# Altium project chronos-pcb.PrjPcb (part 2 of 2)

## Sheet tube-control.SchDoc
size B portrait; SheetNumber: 7; SheetTotal: 9
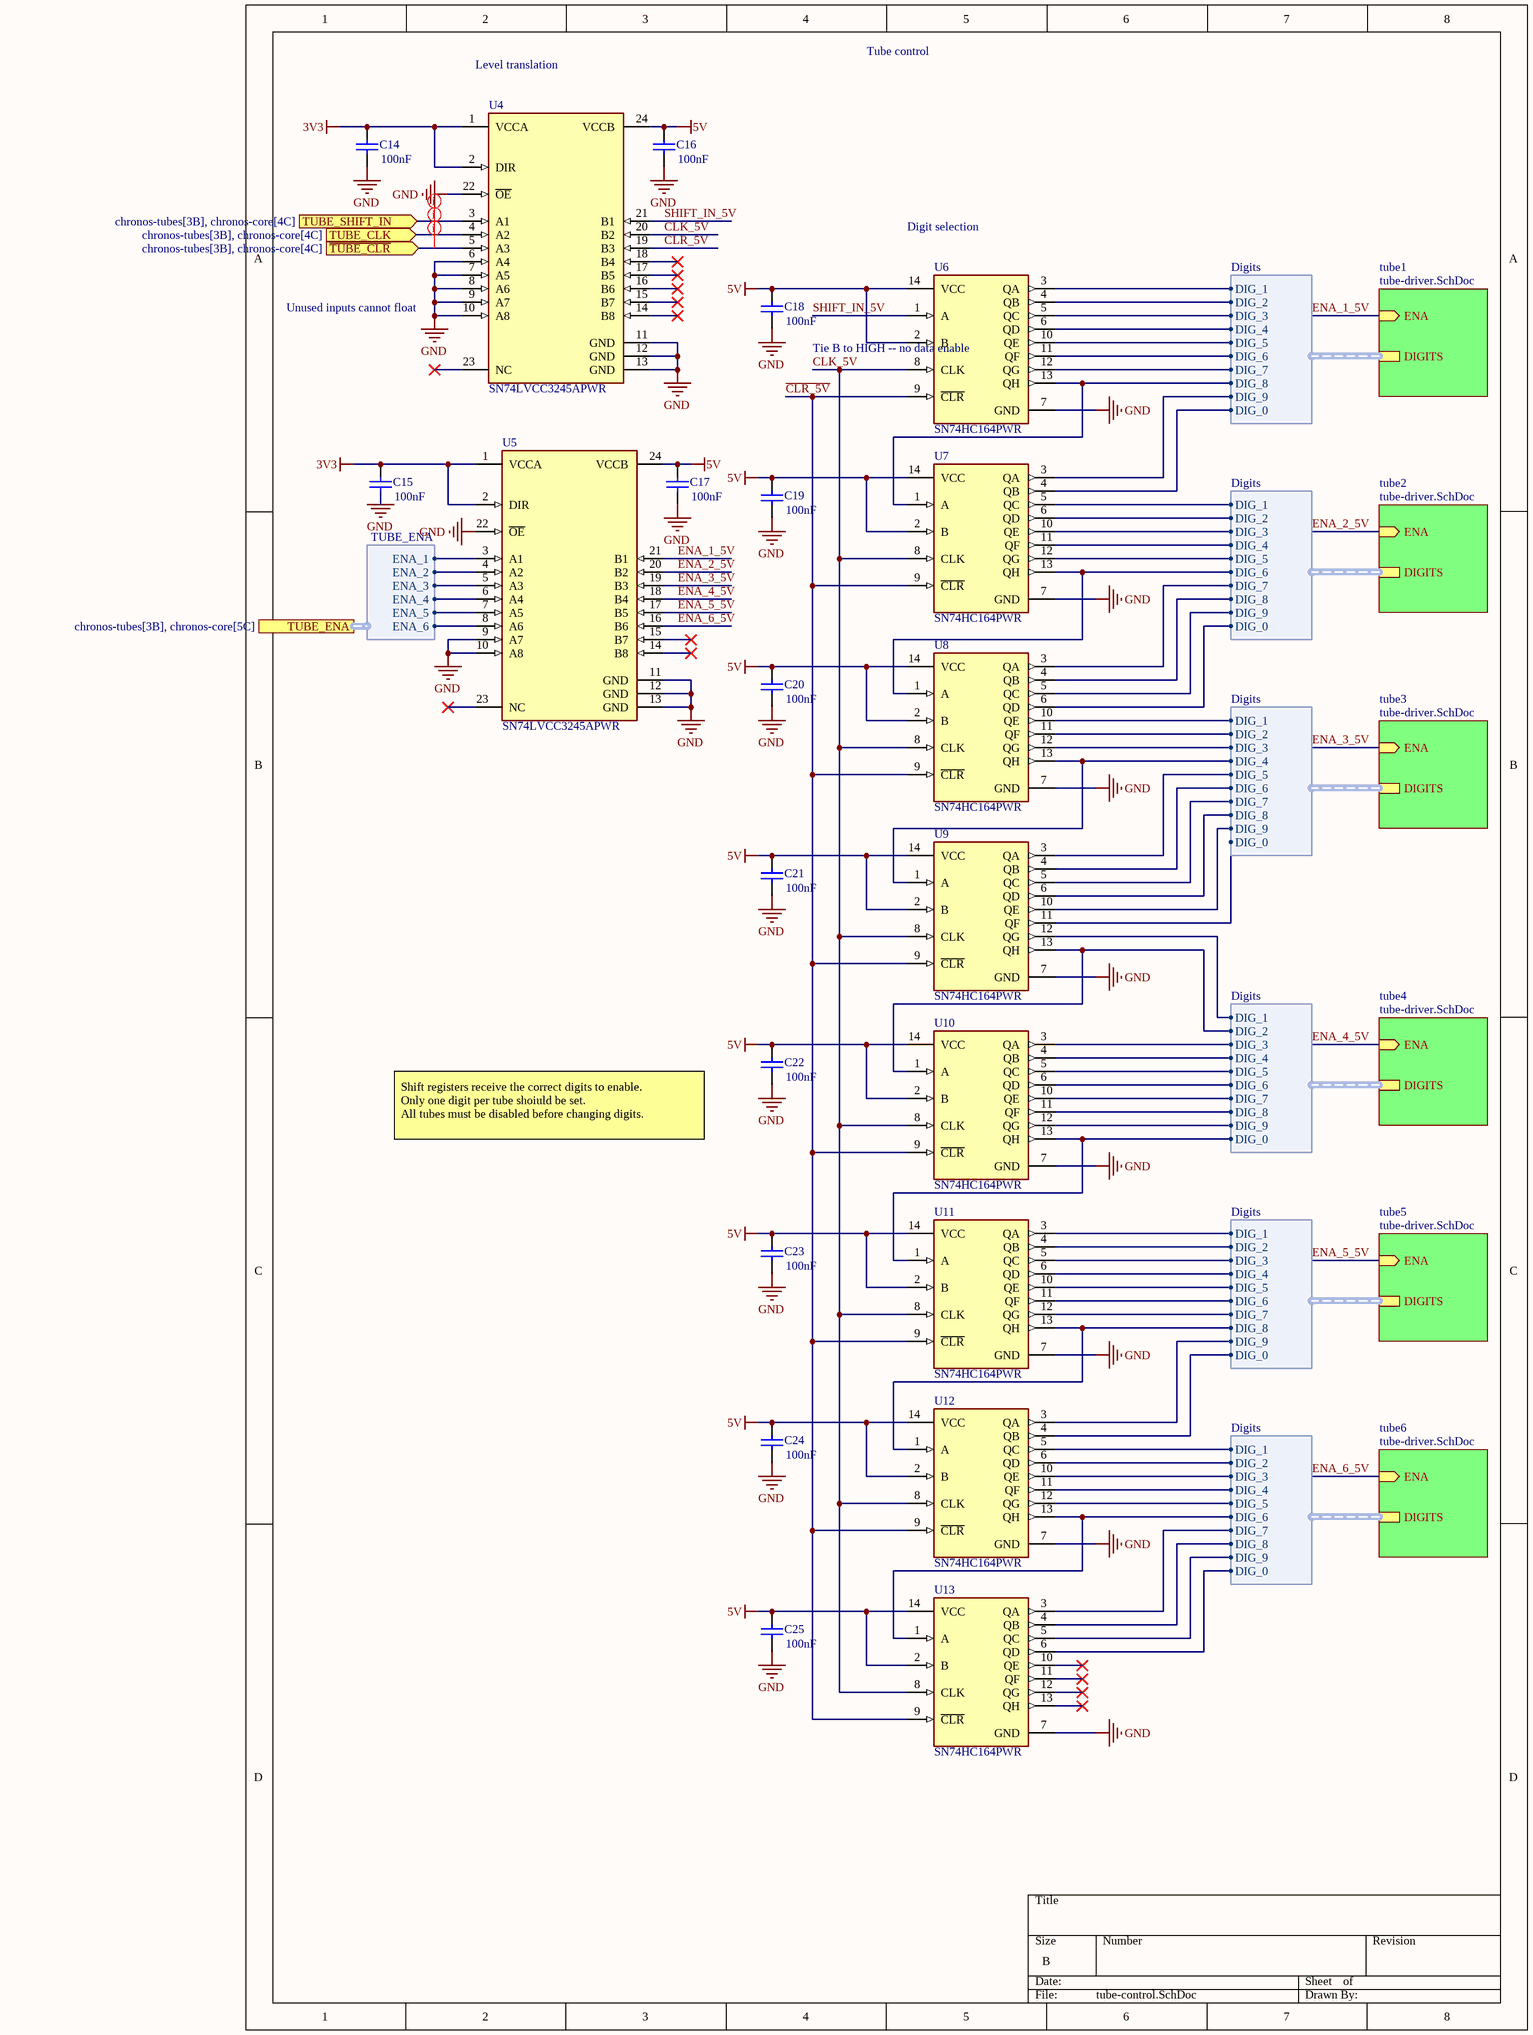
[diagram p7: tube-control.SchDoc]

### Parts
C14  Capacitance: 100nF  [CAPC1050X55X23ML05T13]  (hidden comment: CL05B104KO5NNNC)
C15  Capacitance: 100nF  [CAPC1050X55X23ML05T13]  (hidden comment: CL05B104KO5NNNC)
C16  Capacitance: 100nF  [CAPC1050X55X23ML05T13]  (hidden comment: CL05B104KO5NNNC)
C17  Capacitance: 100nF  [CAPC1050X55X23ML05T13]  (hidden comment: CL05B104KO5NNNC)
C18  Capacitance: 100nF  [CAPC1050X55X23ML05T13]  (hidden comment: CL05B104KO5NNNC)
C19  Capacitance: 100nF  [CAPC1050X55X23ML05T13]  (hidden comment: CL05B104KO5NNNC)
C20  Capacitance: 100nF  [CAPC1050X55X23ML05T13]  (hidden comment: CL05B104KO5NNNC)
C21  Capacitance: 100nF  [CAPC1050X55X23ML05T13]  (hidden comment: CL05B104KO5NNNC)
C22  Capacitance: 100nF  [CAPC1050X55X23ML05T13]  (hidden comment: CL05B104KO5NNNC)
C23  Capacitance: 100nF  [CAPC1050X55X23ML05T13]  (hidden comment: CL05B104KO5NNNC)
C24  Capacitance: 100nF  [CAPC1050X55X23ML05T13]  (hidden comment: CL05B104KO5NNNC)
C25  Capacitance: 100nF  [CAPC1050X55X23ML05T13]  (hidden comment: CL05B104KO5NNNC)
U4  SN74LVCC3245APWR  [FP-PW0024A-MFG]
U5  SN74LVCC3245APWR  [FP-PW0024A-MFG]
U6  SN74HC164PWR  [FP-PW0014A-MFG]
U7  SN74HC164PWR  [FP-PW0014A-MFG]
U8  SN74HC164PWR  [FP-PW0014A-MFG]
U9  SN74HC164PWR  [FP-PW0014A-MFG]
U10  SN74HC164PWR  [FP-PW0014A-MFG]
U11  SN74HC164PWR  [FP-PW0014A-MFG]
U12  SN74HC164PWR  [FP-PW0014A-MFG]
U13  SN74HC164PWR  [FP-PW0014A-MFG]

### Sub-sheets
tube1 = tube-driver.SchDoc: ENA (in), DIGITS (harness Digits)
tube2 = tube-driver.SchDoc: ENA (in), DIGITS (harness Digits)
tube3 = tube-driver.SchDoc: ENA (in), DIGITS (harness Digits)
tube4 = tube-driver.SchDoc: ENA (in), DIGITS (harness Digits)
tube5 = tube-driver.SchDoc: ENA (in), DIGITS (harness Digits)
tube6 = tube-driver.SchDoc: ENA (in), DIGITS (harness Digits)

### Ports
TUBE_CLK (in, see chronos-tubes[3B], chronos-core[4C]), TUBE_ENA (harness TUBE_ENA, see chronos-tubes[3B], chronos-core[5C]), TUBE_SHIFT_IN (in, see chronos-tubes[3B], chronos-core[4C]), ~{TUBE_CLR} (in, see chronos-tubes[3B], chronos-core[4C])

### Harnesses
Digits: DIG_1, DIG_2, DIG_3, DIG_4, DIG_5, DIG_6, DIG_7, DIG_8, DIG_9, DIG_0
TUBE_ENA: ENA_1, ENA_2, ENA_3, ENA_4, ENA_5, ENA_6

### Nets
3V3: C14.2 C15.2 U4.1(VCCA) U4.2(DIR) U5.1(VCCA) U5.2(DIR)
5V: C16.2 C17.2 C18.2 C19.2 C20.2 C21.2 C22.2 C23.2 C24.2 C25.2 U4.24(VCCB) U5.24(VCCB) U6.2(B) U6.14(VCC) U7.2(B) U7.14(VCC) U8.2(B) U8.14(VCC) U9.2(B) U9.14(VCC) U10.2(B) U10.14(VCC) U11.2(B) U11.14(VCC) U12.2(B) U12.14(VCC) U13.2(B) U13.14(VCC)
GND: C14.1 C15.1 C16.1 C17.1 C18.1 C19.1 C20.1 C21.1 C22.1 C23.1 C24.1 C25.1 U4.6(A4) U4.7(A5) U4.8(A6) U4.9(A7) U4.10(A8) U4.11(GND) U4.12(GND) U4.13(GND) U4.22(~{OE}) U5.9(A7) U5.10(A8) U5.11(GND) U5.12(GND) U5.13(GND) U5.22(~{OE}) U6.7(GND) U7.7(GND) U8.7(GND) U9.7(GND) U10.7(GND) U11.7(GND) U12.7(GND) U13.7(GND)
~{CLR_5V}: U4.19(B3) U6.9(~{CLR}) U7.9(~{CLR}) U8.9(~{CLR}) U9.9(~{CLR}) U10.9(~{CLR}) U11.9(~{CLR}) U12.9(~{CLR}) U13.9(~{CLR})
CLK_5V: U4.20(B2) U6.8(CLK) U7.8(CLK) U8.8(CLK) U9.8(CLK) U10.8(CLK) U11.8(CLK) U12.8(CLK) U13.8(CLK)
DIG_0: U7.4(QB) ; sheet tube1/DIGITS.DIG_0
DIG_0: U8.6(QD) ; sheet tube2/DIGITS.DIG_0  [a separate net that carries the same name]
DIG_0: U9.11(QF) ; sheet tube3/DIGITS.DIG_0  [a separate net that carries the same name]
DIG_0: U10.13(QH) U11.1(A) ; sheet tube4/DIGITS.DIG_0  [a separate net that carries the same name]
DIG_0: U12.4(QB) ; sheet tube5/DIGITS.DIG_0  [a separate net that carries the same name]
DIG_0: U13.6(QD) ; sheet tube6/DIGITS.DIG_0  [a separate net that carries the same name]
DIG_1: U6.3(QA) ; sheet tube1/DIGITS.DIG_1
DIG_1: U7.5(QC) ; sheet tube2/DIGITS.DIG_1  [a separate net that carries the same name]
DIG_1: U8.10(QE) ; sheet tube3/DIGITS.DIG_1  [a separate net that carries the same name]
DIG_1: U9.12(QG) ; sheet tube4/DIGITS.DIG_1  [a separate net that carries the same name]
DIG_1: U11.3(QA) ; sheet tube5/DIGITS.DIG_1  [a separate net that carries the same name]
DIG_1: U12.5(QC) ; sheet tube6/DIGITS.DIG_1  [a separate net that carries the same name]
DIG_2: U6.4(QB) ; sheet tube1/DIGITS.DIG_2
DIG_2: U7.6(QD) ; sheet tube2/DIGITS.DIG_2  [a separate net that carries the same name]
DIG_2: U8.11(QF) ; sheet tube3/DIGITS.DIG_2  [a separate net that carries the same name]
DIG_2: U9.13(QH) U10.1(A) ; sheet tube4/DIGITS.DIG_2  [a separate net that carries the same name]
DIG_2: U11.4(QB) ; sheet tube5/DIGITS.DIG_2  [a separate net that carries the same name]
DIG_2: U12.6(QD) ; sheet tube6/DIGITS.DIG_2  [a separate net that carries the same name]
DIG_3: U6.5(QC) ; sheet tube1/DIGITS.DIG_3
DIG_3: U7.10(QE) ; sheet tube2/DIGITS.DIG_3  [a separate net that carries the same name]
DIG_3: U8.12(QG) ; sheet tube3/DIGITS.DIG_3  [a separate net that carries the same name]
DIG_3: U10.3(QA) ; sheet tube4/DIGITS.DIG_3  [a separate net that carries the same name]
DIG_3: U11.5(QC) ; sheet tube5/DIGITS.DIG_3  [a separate net that carries the same name]
DIG_3: U12.10(QE) ; sheet tube6/DIGITS.DIG_3  [a separate net that carries the same name]
DIG_4: U6.6(QD) ; sheet tube1/DIGITS.DIG_4
DIG_4: U7.11(QF) ; sheet tube2/DIGITS.DIG_4  [a separate net that carries the same name]
DIG_4: U8.13(QH) U9.1(A) ; sheet tube3/DIGITS.DIG_4  [a separate net that carries the same name]
DIG_4: U10.4(QB) ; sheet tube4/DIGITS.DIG_4  [a separate net that carries the same name]
DIG_4: U11.6(QD) ; sheet tube5/DIGITS.DIG_4  [a separate net that carries the same name]
DIG_4: U12.11(QF) ; sheet tube6/DIGITS.DIG_4  [a separate net that carries the same name]
DIG_5: U6.10(QE) ; sheet tube1/DIGITS.DIG_5
DIG_5: U7.12(QG) ; sheet tube2/DIGITS.DIG_5  [a separate net that carries the same name]
DIG_5: U9.3(QA) ; sheet tube3/DIGITS.DIG_5  [a separate net that carries the same name]
DIG_5: U10.5(QC) ; sheet tube4/DIGITS.DIG_5  [a separate net that carries the same name]
DIG_5: U11.10(QE) ; sheet tube5/DIGITS.DIG_5  [a separate net that carries the same name]
DIG_5: U12.12(QG) ; sheet tube6/DIGITS.DIG_5  [a separate net that carries the same name]
DIG_6: U6.11(QF) ; sheet tube1/DIGITS.DIG_6
DIG_6: U7.13(QH) U8.1(A) ; sheet tube2/DIGITS.DIG_6  [a separate net that carries the same name]
DIG_6: U9.4(QB) ; sheet tube3/DIGITS.DIG_6  [a separate net that carries the same name]
DIG_6: U10.6(QD) ; sheet tube4/DIGITS.DIG_6  [a separate net that carries the same name]
DIG_6: U11.11(QF) ; sheet tube5/DIGITS.DIG_6  [a separate net that carries the same name]
DIG_6: U12.13(QH) U13.1(A) ; sheet tube6/DIGITS.DIG_6  [a separate net that carries the same name]
DIG_7: U6.12(QG) ; sheet tube1/DIGITS.DIG_7
DIG_7: U8.3(QA) ; sheet tube2/DIGITS.DIG_7  [a separate net that carries the same name]
DIG_7: U9.5(QC) ; sheet tube3/DIGITS.DIG_7  [a separate net that carries the same name]
DIG_7: U10.10(QE) ; sheet tube4/DIGITS.DIG_7  [a separate net that carries the same name]
DIG_7: U11.12(QG) ; sheet tube5/DIGITS.DIG_7  [a separate net that carries the same name]
DIG_7: U13.3(QA) ; sheet tube6/DIGITS.DIG_7  [a separate net that carries the same name]
DIG_8: U6.13(QH) U7.1(A) ; sheet tube1/DIGITS.DIG_8
DIG_8: U8.4(QB) ; sheet tube2/DIGITS.DIG_8  [a separate net that carries the same name]
DIG_8: U9.6(QD) ; sheet tube3/DIGITS.DIG_8  [a separate net that carries the same name]
DIG_8: U10.11(QF) ; sheet tube4/DIGITS.DIG_8  [a separate net that carries the same name]
DIG_8: U11.13(QH) U12.1(A) ; sheet tube5/DIGITS.DIG_8  [a separate net that carries the same name]
DIG_8: U13.4(QB) ; sheet tube6/DIGITS.DIG_8  [a separate net that carries the same name]
DIG_9: U7.3(QA) ; sheet tube1/DIGITS.DIG_9
DIG_9: U8.5(QC) ; sheet tube2/DIGITS.DIG_9  [a separate net that carries the same name]
DIG_9: U9.10(QE) ; sheet tube3/DIGITS.DIG_9  [a separate net that carries the same name]
DIG_9: U10.12(QG) ; sheet tube4/DIGITS.DIG_9  [a separate net that carries the same name]
DIG_9: U12.3(QA) ; sheet tube5/DIGITS.DIG_9  [a separate net that carries the same name]
DIG_9: U13.5(QC) ; sheet tube6/DIGITS.DIG_9  [a separate net that carries the same name]
ENA_1_5V: U5.21(B1) ; sheet tube1/ENA
ENA_2_5V: U5.20(B2) ; sheet tube2/ENA
ENA_3_5V: U5.19(B3) ; sheet tube3/ENA
ENA_4_5V: U5.18(B4) ; sheet tube4/ENA
ENA_5_5V: U5.17(B5) ; sheet tube5/ENA
ENA_6_5V: U5.16(B6) ; sheet tube6/ENA
GPIO_C6: U5.6(A4) ; port TUBE_ENA.ENA_4
GPIO_C7: U5.7(A5) ; port TUBE_ENA.ENA_5
GPIO_C8: U5.8(A6) ; port TUBE_ENA.ENA_6
GPIO_D10: U4.3(A1) ; port TUBE_SHIFT_IN
GPIO_D11: U4.4(A2) ; port TUBE_CLK
GPIO_D12: U4.5(A3) ; port ~{TUBE_CLR}
GPIO_D13: U5.3(A1) ; port TUBE_ENA.ENA_1
GPIO_D14: U5.4(A2) ; port TUBE_ENA.ENA_2
GPIO_D15: U5.5(A3) ; port TUBE_ENA.ENA_3
SHIFT_IN_5V: U4.21(B1) U6.1(A)

Not connected (* = marked no-connect by the designer): U4 14(B8)* 15(B7)* 16(B6)* 17(B5)* 18(B4)* 23(NC)*; U5 14(B8)* 15(B7)* 23(NC)*; U13 10(QE)* 11(QF)* 12(QG)* 13(QH)*

### Layout directives
net class TUBE_CONTROL: GPIO_D10, GPIO_D11, GPIO_D12

### Notes on the sheet
- Level translation
- Tube control
- Digit selection
- (near U4) Unused inputs cannot float
- (near U6) Tie B to HIGH -- no data enable
- Shift registers receive the correct digits to enable.
  Only one digit per tube shoiuld be set.
  All tubes must be disabled before changing digits.

### Library data of the parts
C14-C25 = CMP-2000-05439-1: Chip Capacitor, 100 nF, +/- 10%, 16 V, -55 to 125 degC, 0402 (1005 Metric), RoHS, Tape and Reel; Manufacturer: Samsung Electro-Mechanics; Dielectric: X7R; Rated Voltage: 16V; Case Size/Dimension: 0402; Tolerance (%): ±10%; Manufacturer URL: http://www.samsungsem.com/global/index.jsp; Datasheet URL: https://datasheet.ciiva.com/29198/458718-da-01-en-vs-kondensator-0402-29198423.pdf; Datasheet Version: Nov-10
U4 U5 = CMP-04899-000013-1: IC TRNSLTR BIDIRECTIONAL 24TSSOP; Manufacturer: Texas Instruments; Number Of Inputs: 1; V A Min: 2.3V; V A Max: 3.6V; Max Junction Temp: +150°C; V B Max: 5.5V; Number Of Circuits: 8; Standoff Height: 0.05mm; Nominal Supply Current: 5-8uA; Logic Function Desc: Non-Inverting; V B Min: 3V; Device Class L3: Voltage Level Shifters; ComponentLink2Description: Datasheet; Manufacturer Part Number: SN74LVCC3245APWR; Device Class L2: Logic ICs; Digikey Description: IC TRNSLTR BIDIRECTIONAL 24TSSOP; Min Supply Voltage: 2.3V; Temperature Range High: +85°C; Automotive: No; Mouser Description: Octal Bus Transceiver With Adjustable Output Voltage and 3-State Outputs 24-TSSOP -40 to 85; RoHS: TRUE; Package: PW0024A; Number Of Outputs: 1; Lead Free: Yes; Temperature Range Low: -40°C; Ambient Temperature Range High: +85°C; Ambient Temperature Range Low: -40°C; Max Supply Voltage: 5.5V; Category: IC; Octopart: https://octopart.com/sn74lvcc3245apwr-texas+instruments-517488; Device Class L1: Integrated Circuits (ICs); Height: 1.2mm; ComponentLink2URL: http://www.ti.com/lit/ds/symlink/sn74lvcc3245a.pdf; Temperature: -40°C to +85°C
U6-U13 = CMP-0780-00172-4: IC SHFT REG SERIAL 8BIT 14-TSSOP; Manufacturer: Texas Instruments; Min Supply Voltage: 2V; Standoff Height: 0.05mm; Number Of Circuits: 1; Max Supply Voltage: 6V; Frequency: 36MHz; Nominal Supply Current: 160uA; Number Of Outputs: 8; Propagation Delay: 20ns; Number Of Inputs: 2; Logic Function Desc: Shift Register; Temperature: -40°C to +125°C; Package: PW0014A; Automotive: No; Device Class L3: Shift Registers; Ambient Temperature Range Low: -40°C; Device Class L1: Integrated Circuits (ICs); ComponentLink2Description: Datasheet; Category: IC; Manufacturer Part Number: SN74HC164PWR; Device Class L2: Logic ICs; Mouser Description: Shift Register Single 8-Bit Serial to Parallel 14-Pin TSSOP T/R; ComponentLink2URL: http://www.ti.com/lit/ds/symlink/sn74hc164.pdf; Lead Free: Yes; Height: 1.2mm; Ambient Temperature Range High: +125°C; Octopart: https://octopart.com/sn74hc164pwr-texas+instruments-500613; RoHS: TRUE; Temperature Range High: +125°C; Digikey Description: IC SHFT REG SERIAL 8BIT 14-TSSOP; Temperature Range Low: -40°C

## Sheet tube-driver.SchDoc
size B; SheetNumber: 8; SheetTotal: 9
Used 6 times, as channels tube-control/tube1, tube-control/tube2, tube-control/tube3, tube-control/tube4, tube-control/tube5, tube-control/tube6. Parts and nets are listed once, with the designators drawn on the sheet.
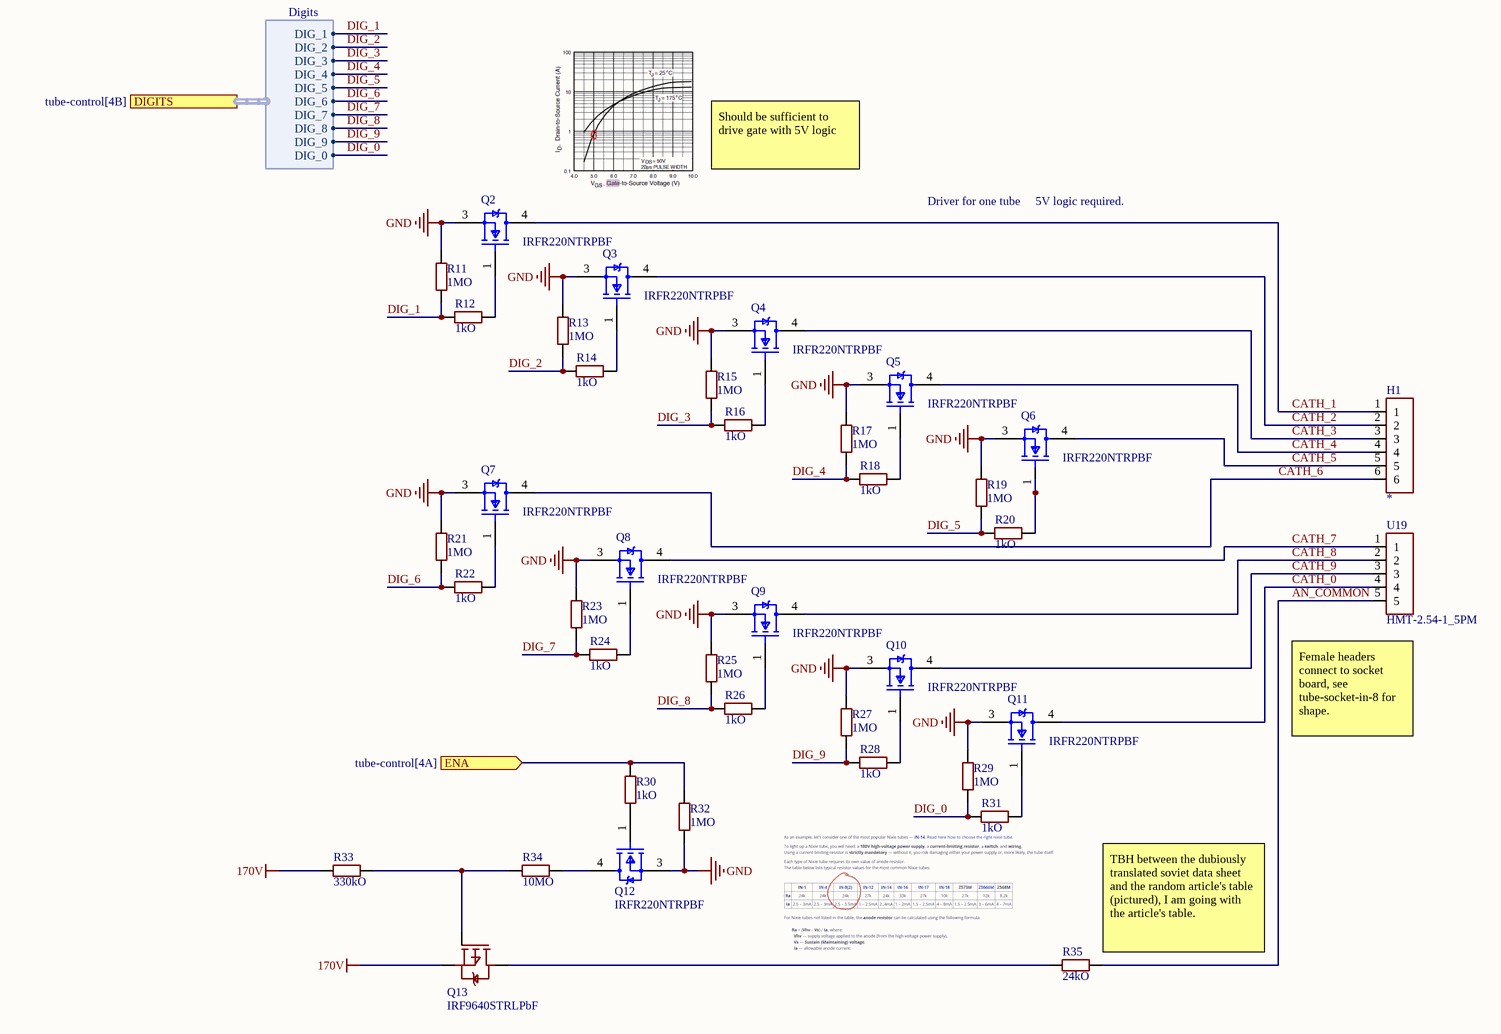
[diagram p8: tube-driver.SchDoc]

### Parts
H1  2.54-1_6P  [2.54-1_6P]  (value not drawn)
Q2  IRFR220NTRPBF  [FP-PG-TO252-3-MFG]
Q3  IRFR220NTRPBF  [FP-PG-TO252-3-MFG]
Q4  IRFR220NTRPBF  [FP-PG-TO252-3-MFG]
Q5  IRFR220NTRPBF  [FP-PG-TO252-3-MFG]
Q6  IRFR220NTRPBF  [FP-PG-TO252-3-MFG]
Q7  IRFR220NTRPBF  [FP-PG-TO252-3-MFG]
Q8  IRFR220NTRPBF  [FP-PG-TO252-3-MFG]
Q9  IRFR220NTRPBF  [FP-PG-TO252-3-MFG]
Q10  IRFR220NTRPBF  [FP-PG-TO252-3-MFG]
Q11  IRFR220NTRPBF  [FP-PG-TO252-3-MFG]
Q12  IRFR220NTRPBF  [FP-PG-TO252-3-MFG]
Q13  IRF9640STRLPbF  [IRF9640STRLPbF]
R11  value 1MO  [0402WGF1004TCE]  (hidden comment: 0402WGF1004TCE)
R12  value 1kO  [0402WGF1001TCE]  (hidden comment: 0402WGF1001TCE)
R13  value 1MO  [0402WGF1004TCE]  (hidden comment: 0402WGF1004TCE)
R14  value 1kO  [0402WGF1001TCE]  (hidden comment: 0402WGF1001TCE)
R15  value 1MO  [0402WGF1004TCE]  (hidden comment: 0402WGF1004TCE)
R16  value 1kO  [0402WGF1001TCE]  (hidden comment: 0402WGF1001TCE)
R17  value 1MO  [0402WGF1004TCE]  (hidden comment: 0402WGF1004TCE)
R18  value 1kO  [0402WGF1001TCE]  (hidden comment: 0402WGF1001TCE)
R19  value 1MO  [0402WGF1004TCE]  (hidden comment: 0402WGF1004TCE)
R20  value 1kO  [0402WGF1001TCE]  (hidden comment: 0402WGF1001TCE)
R21  value 1MO  [0402WGF1004TCE]  (hidden comment: 0402WGF1004TCE)
R22  value 1kO  [0402WGF1001TCE]  (hidden comment: 0402WGF1001TCE)
R23  value 1MO  [0402WGF1004TCE]  (hidden comment: 0402WGF1004TCE)
R24  value 1kO  [0402WGF1001TCE]  (hidden comment: 0402WGF1001TCE)
R25  value 1MO  [0402WGF1004TCE]  (hidden comment: 0402WGF1004TCE)
R26  value 1kO  [0402WGF1001TCE]  (hidden comment: 0402WGF1001TCE)
R27  value 1MO  [0402WGF1004TCE]  (hidden comment: 0402WGF1004TCE)
R28  value 1kO  [0402WGF1001TCE]  (hidden comment: 0402WGF1001TCE)
R29  value 1MO  [0402WGF1004TCE]  (hidden comment: 0402WGF1004TCE)
R30  value 1kO  [0402WGF1001TCE]  (hidden comment: 0402WGF1001TCE)
R31  value 1kO  [0402WGF1001TCE]  (hidden comment: 0402WGF1001TCE)
R32  value 1MO  [0402WGF1004TCE]  (hidden comment: 0402WGF1004TCE)
R33  value 330kO  [0603WAF3303T5E]  (hidden comment: 0603WAF3303T5E)
R34  value 10MO  [0603WAF1005T5E]  (hidden comment: 0603WAF1005T5E)
R35  value 24kO  [0603WAF2402T5E]  (hidden comment: 0603WAF2402T5E)
U19  HMT-2.54-1_5PM  [HMT-2.54-1_5PM]

### Ports
DIGITS (harness Digits, see tube-control[4B]), ENA (in, see tube-control[4A])

### Harnesses
Digits: DIG_1, DIG_2, DIG_3, DIG_4, DIG_5, DIG_6, DIG_7, DIG_8, DIG_9, DIG_0

### Nets
170V: Q13.3(S) R33.1
GND: Q2.3(SOURCE) Q3.3(SOURCE) Q4.3(SOURCE) Q5.3(SOURCE) Q6.3(SOURCE) Q7.3(SOURCE) Q8.3(SOURCE) Q9.3(SOURCE) Q10.3(SOURCE) Q11.3(SOURCE) Q12.3(SOURCE) R11.2 R13.2 R15.2 R17.2 R19.2 R21.2 R23.2 R25.2 R27.2 R29.2 R32.1
AN_COMMON: R35.2 U19.5
CATH_0: Q11.4(DRAIN) U19.4
CATH_1: H1.1 Q2.4(DRAIN)
CATH_2: H1.2 Q3.4(DRAIN)
CATH_3: H1.3 Q4.4(DRAIN)
CATH_4: H1.4 Q5.4(DRAIN)
CATH_5: H1.5 Q6.4(DRAIN)
CATH_6: H1.6 Q7.4(DRAIN)
CATH_7: Q8.4(DRAIN) U19.1
CATH_8: Q9.4(DRAIN) U19.2
CATH_9: Q10.4(DRAIN) U19.3
DIG_0: R29.1 R31.1 ; port DIGITS.DIG_0
DIG_1: R11.1 R12.1 ; port DIGITS.DIG_1
DIG_2: R13.1 R14.1 ; port DIGITS.DIG_2
DIG_3: R15.1 R16.1 ; port DIGITS.DIG_3
DIG_4: R17.1 R18.1 ; port DIGITS.DIG_4
DIG_5: R19.1 R20.1 ; port DIGITS.DIG_5
DIG_6: R21.1 R22.1 ; port DIGITS.DIG_6
DIG_7: R23.1 R24.1 ; port DIGITS.DIG_7
DIG_8: R25.1 R26.1 ; port DIGITS.DIG_8
DIG_9: R27.1 R28.1 ; port DIGITS.DIG_9
ENA: R30.2 R32.2 ; port ENA
NetQ2_1: Q2.1(GATE) R12.2
NetQ3_1: Q3.1(GATE) R14.2
NetQ4_1: Q4.1(GATE) R16.2
NetQ5_1: Q5.1(GATE) R18.2
NetQ6_1: Q6.1(GATE) R20.2
NetQ7_1: Q7.1(GATE) R22.2
NetQ8_1: Q8.1(GATE) R24.2
NetQ9_1: Q9.1(GATE) R26.2
NetQ10_1: Q10.1(GATE) R28.2
NetQ11_1: Q11.1(GATE) R31.2
NetQ12_1: Q12.1(GATE) R30.1
NetQ12_4: Q12.4(DRAIN) R34.2
NetQ13_1: Q13.1(G) R33.2 R34.1
NetQ13_4: Q13.4(D) R35.1

### Channels
tube-control/tube1: designators end in _tube1; ports ENA=ENA_1_5V
tube-control/tube2: designators end in _tube2; ports ENA=ENA_2_5V
tube-control/tube3: designators end in _tube3; ports ENA=ENA_3_5V
tube-control/tube4: designators end in _tube4; ports ENA=ENA_4_5V
tube-control/tube5: designators end in _tube5; ports ENA=ENA_5_5V
tube-control/tube6: designators end in _tube6; ports ENA=ENA_6_5V

### Notes on the sheet
- Should be sufficient to drive gate with 5V logic
- Driver for one tube
- 5V logic required.
- (near U19) Female headers connect to socket board, see tube-socket-in-8 for shape.
- (near R35) TBH between the dubiously translated soviet data sheet and the random article's table (pictured), I am going with the article's table.

### Library data of the parts
H1 = 2.54-1_6P: Pin Headers. -40C~+105C 1 1x6P 2.54mm 3.3mm 3A 6P Brass Square Hole Through Hole Top ,P=2.54mm Female Headers ROHS; Manufacturer Part Number: 2.54-1*6P; Manufacturer: BOOMELE(Boom Precision Elec); Component Type: Connectors; Design Item ID: 2.54-1_6P; Value: *; JLCPCB Part #: C40877
Q2-Q12 = CMP-32901-000070-1: MOSFET N-CH 200V 5A DPAK; Manufacturer: Infineon; Gate Charge At Vgs: 15nC @ 10V; Rthja Max: 110°C/W; Gate To Source Voltage: 20V; Pulse Drain Current: 20A; Threshold Vgs Max: 4V; Max Junction Temp: +175°C; Drain To Source Resistance: 600mΩ; Number Of N Channels: 1; Depletion Mode: False; Max Forward Diode Voltage: 1.3V; Turn On Delay Time: 6.4ns; Power Dissipation: 43W; Reverse Recovery Time: 90ns; Threshold Vgs Min: 2V; Reverse Recovery Charge: 320nC; Turn Off Delay Time: 20ns; Input Capacitace At Vds: 300pF @ 25V; Package: PG-TO252-3; Height: 2.52mm; RoHS: TRUE; Device Class L2: Transistors; Octopart: https://octopart.com/irfr220ntrpbf-infineon-65874086; Manufacturer Part Number: IRFR220NTRPBF; Digikey Description: MOSFET N-CH 200V 5A DPAK; ComponentLink2Description: Datasheet; Temperature Range Low: -55°C; Footprint Url: http://www.irf.com/package/hexfet/dpakfootprint.pdf; Device Class L1: Discrete Semiconductors; Continuous Drain Current: 5A; Category: Trans; Drain To Source Breakdown Voltage: 200V; Automotive: No; Lead Free: Yes; Drain To Source Voltage: 200V; Temperature Range High: +175°C; Device Class L3: MOSFETs; Number Of Channels: 1; ComponentLink2URL: https://www.infineon.com/dgdl/irfr220npbf.pdf?fileId=5546d462533600a40153562d8a7b206f; Temperature: -55°C to +175°C
Q13 = IRF9640STRLPbF: MOSFETs. -55C~+150C 1 P-Channel 1.2nF 125W 200V 370pF 44nC@10V 4V 500mohm@10V 6.8A 81pF P-Channel TO-263(D2PAK) MOSFETs ROHS; Manufacturer: Vishay Intertech; Component Type: Transistors; Design Item ID: IRF9640STRLPbF; Value: IRF9640STRLPbF; JLCPCB Part #: C2629; Manufacturer Part Number: IRF9640STRLPbF
R11 R13 R15 R17 R19 R21 R23 R25 R27 R29 R32 = 0402WGF1004TCE: Resistors. -55C~+155C 1Mohm 50V 62.5mW Thick Film Resistor +/-1% +/-100ppm/C 0402 Chip Resistor - Surface Mount ROHS; Manufacturer: UNI-ROYAL(Uniroyal Elec); Component Type: Resistors; Design Item ID: 0402WGF1004TCE; JLCPCB Part #: C26083; Manufacturer Part Number: 0402WGF1004TCE
R12 R14 R16 R18 R20 R22 R24 R26 R28 R30 R31 = 0402WGF1001TCE: Resistors. -55C~+155C 1kohm 50V 62.5mW Thick Film Resistor +/-1% +/-100ppm/C 0402 Chip Resistor - Surface Mount ROHS; Manufacturer: UNI-ROYAL(Uniroyal Elec); Component Type: Resistors; Design Item ID: 0402WGF1001TCE; JLCPCB Part #: C11702; Manufacturer Part Number: 0402WGF1001TCE
R33 = 0603WAF3303T5E: Resistors. -55C~+155C 100mW 330kohm 75V Thick Film Resistor +/-1% +/-100ppm/C 0603 Chip Resistor - Surface Mount ROHS; Manufacturer: UNI-ROYAL(Uniroyal Elec); Component Type: Resistors; Design Item ID: 0603WAF3303T5E; JLCPCB Part #: C23137; Manufacturer Part Number: 0603WAF3303T5E
R34 = 0603WAF1005T5E: Resistors. -55C~+155C 100mW 10Mohm 75V Thick Film Resistor +/-1% +/-100ppm/C 0603 Chip Resistor - Surface Mount ROHS; Manufacturer: UNI-ROYAL(Uniroyal Elec); Component Type: Resistors; Design Item ID: 0603WAF1005T5E; JLCPCB Part #: C7250; Manufacturer Part Number: 0603WAF1005T5E
R35 = 0603WAF2402T5E: Resistors. -55C~+155C 100mW 24kohm 75V Thick Film Resistor +/-1% +/-100ppm/C 0603 Chip Resistor - Surface Mount ROHS; Manufacturer: UNI-ROYAL(Uniroyal Elec); Component Type: Resistors; Design Item ID: 0603WAF2402T5E; JLCPCB Part #: C23352; Manufacturer Part Number: 0603WAF2402T5E
U19 = HMT-2.54-1_5PM: Female Headers. -40C~+105C 1 1x5P 2.54mm 2.54mm 3.2mm 3A 5P 8.5mm Brass Gold Square Hole Through Hole Top ,P=2.54mm Female Headers ROHS; Manufacturer Part Number: HMT-2.54-1*5PM; Manufacturer: HMTCONN; Component Type: Integrated Circuits; Design Item ID: HMT-2.54-1_5PM; Value: *; JLCPCB Part #: C54620386

## Nets that join several sheets
3V3: chronos-core (21 pins), wifi (9 pins), gps (5 pins), config-interface (DS1.34 DS1.35), lv-supply (C65.2 U18.2), tube-control (6 pins)
5V: lv-supply (5 pins), hv-supply (12 pins), tube-control (28 pins)
170V: hv-supply (5 pins), tube-control/tube1 (Q13_tube1.3 R33_tube1.1), tube-control/tube2 (Q13_tube2.3 R33_tube2.1), tube-control/tube3 (Q13_tube3.3 R33_tube3.1), tube-control/tube4 (Q13_tube4.3 R33_tube4.1), tube-control/tube5 (Q13_tube5.3 R33_tube5.1), tube-control/tube6 (Q13_tube6.3 R33_tube6.1)
GND: chronos-core (29 pins), wifi (46 pins), gps (MD1.1 MD1.10 MD1.12), config-interface (19 pins), lv-supply (7 pins), hv-supply (20 pins), tube-control (35 pins), tube-control/tube1 (22 pins), tube-control/tube2 (22 pins), tube-control/tube3 (22 pins), tube-control/tube4 (22 pins), tube-control/tube5 (22 pins), tube-control/tube6 (22 pins)
~{DISPLAY_RESET}: chronos-core (U14.47), config-interface (DS1.39)
~{DISPLAY_SPI_CS}: chronos-core (U14.43), config-interface (DS1.40)
~{WIFI_QSPI_CS}: chronos-core (U14.42), wifi (U15.36)
CONFIG_ENABLE: chronos-core (U14.88), config-interface (SW2.1)
DIG_0: tube-control (U7.4), tube-control/tube1 (R29_tube1.1 R31_tube1.1)
DIG_0: tube-control (U8.6), tube-control/tube2 (R29_tube2.1 R31_tube2.1)
DIG_0: tube-control (U9.11), tube-control/tube3 (R29_tube3.1 R31_tube3.1)
DIG_0: tube-control (U10.13 U11.1), tube-control/tube4 (R29_tube4.1 R31_tube4.1)
DIG_0: tube-control (U12.4), tube-control/tube5 (R29_tube5.1 R31_tube5.1)
DIG_0: tube-control (U13.6), tube-control/tube6 (R29_tube6.1 R31_tube6.1)
DIG_1: tube-control (U6.3), tube-control/tube1 (R11_tube1.1 R12_tube1.1)
DIG_1: tube-control (U7.5), tube-control/tube2 (R11_tube2.1 R12_tube2.1)
DIG_1: tube-control (U8.10), tube-control/tube3 (R11_tube3.1 R12_tube3.1)
DIG_1: tube-control (U9.12), tube-control/tube4 (R11_tube4.1 R12_tube4.1)
DIG_1: tube-control (U11.3), tube-control/tube5 (R11_tube5.1 R12_tube5.1)
DIG_1: tube-control (U12.5), tube-control/tube6 (R11_tube6.1 R12_tube6.1)
DIG_2: tube-control (U6.4), tube-control/tube1 (R13_tube1.1 R14_tube1.1)
DIG_2: tube-control (U7.6), tube-control/tube2 (R13_tube2.1 R14_tube2.1)
DIG_2: tube-control (U8.11), tube-control/tube3 (R13_tube3.1 R14_tube3.1)
DIG_2: tube-control (U9.13 U10.1), tube-control/tube4 (R13_tube4.1 R14_tube4.1)
DIG_2: tube-control (U11.4), tube-control/tube5 (R13_tube5.1 R14_tube5.1)
DIG_2: tube-control (U12.6), tube-control/tube6 (R13_tube6.1 R14_tube6.1)
DIG_3: tube-control (U6.5), tube-control/tube1 (R15_tube1.1 R16_tube1.1)
DIG_3: tube-control (U7.10), tube-control/tube2 (R15_tube2.1 R16_tube2.1)
DIG_3: tube-control (U8.12), tube-control/tube3 (R15_tube3.1 R16_tube3.1)
DIG_3: tube-control (U10.3), tube-control/tube4 (R15_tube4.1 R16_tube4.1)
DIG_3: tube-control (U11.5), tube-control/tube5 (R15_tube5.1 R16_tube5.1)
DIG_3: tube-control (U12.10), tube-control/tube6 (R15_tube6.1 R16_tube6.1)
DIG_4: tube-control (U6.6), tube-control/tube1 (R17_tube1.1 R18_tube1.1)
DIG_4: tube-control (U7.11), tube-control/tube2 (R17_tube2.1 R18_tube2.1)
DIG_4: tube-control (U8.13 U9.1), tube-control/tube3 (R17_tube3.1 R18_tube3.1)
DIG_4: tube-control (U10.4), tube-control/tube4 (R17_tube4.1 R18_tube4.1)
DIG_4: tube-control (U11.6), tube-control/tube5 (R17_tube5.1 R18_tube5.1)
DIG_4: tube-control (U12.11), tube-control/tube6 (R17_tube6.1 R18_tube6.1)
DIG_5: tube-control (U6.10), tube-control/tube1 (R19_tube1.1 R20_tube1.1)
DIG_5: tube-control (U7.12), tube-control/tube2 (R19_tube2.1 R20_tube2.1)
DIG_5: tube-control (U9.3), tube-control/tube3 (R19_tube3.1 R20_tube3.1)
DIG_5: tube-control (U10.5), tube-control/tube4 (R19_tube4.1 R20_tube4.1)
DIG_5: tube-control (U11.10), tube-control/tube5 (R19_tube5.1 R20_tube5.1)
DIG_5: tube-control (U12.12), tube-control/tube6 (R19_tube6.1 R20_tube6.1)
DIG_6: tube-control (U6.11), tube-control/tube1 (R21_tube1.1 R22_tube1.1)
DIG_6: tube-control (U7.13 U8.1), tube-control/tube2 (R21_tube2.1 R22_tube2.1)
DIG_6: tube-control (U9.4), tube-control/tube3 (R21_tube3.1 R22_tube3.1)
DIG_6: tube-control (U10.6), tube-control/tube4 (R21_tube4.1 R22_tube4.1)
DIG_6: tube-control (U11.11), tube-control/tube5 (R21_tube5.1 R22_tube5.1)
DIG_6: tube-control (U12.13 U13.1), tube-control/tube6 (R21_tube6.1 R22_tube6.1)
DIG_7: tube-control (U6.12), tube-control/tube1 (R23_tube1.1 R24_tube1.1)
DIG_7: tube-control (U8.3), tube-control/tube2 (R23_tube2.1 R24_tube2.1)
DIG_7: tube-control (U9.5), tube-control/tube3 (R23_tube3.1 R24_tube3.1)
DIG_7: tube-control (U10.10), tube-control/tube4 (R23_tube4.1 R24_tube4.1)
DIG_7: tube-control (U11.12), tube-control/tube5 (R23_tube5.1 R24_tube5.1)
DIG_7: tube-control (U13.3), tube-control/tube6 (R23_tube6.1 R24_tube6.1)
DIG_8: tube-control (U6.13 U7.1), tube-control/tube1 (R25_tube1.1 R26_tube1.1)
DIG_8: tube-control (U8.4), tube-control/tube2 (R25_tube2.1 R26_tube2.1)
DIG_8: tube-control (U9.6), tube-control/tube3 (R25_tube3.1 R26_tube3.1)
DIG_8: tube-control (U10.11), tube-control/tube4 (R25_tube4.1 R26_tube4.1)
DIG_8: tube-control (U11.13 U12.1), tube-control/tube5 (R25_tube5.1 R26_tube5.1)
DIG_8: tube-control (U13.4), tube-control/tube6 (R25_tube6.1 R26_tube6.1)
DIG_9: tube-control (U7.3), tube-control/tube1 (R27_tube1.1 R28_tube1.1)
DIG_9: tube-control (U8.5), tube-control/tube2 (R27_tube2.1 R28_tube2.1)
DIG_9: tube-control (U9.10), tube-control/tube3 (R27_tube3.1 R28_tube3.1)
DIG_9: tube-control (U10.12), tube-control/tube4 (R27_tube4.1 R28_tube4.1)
DIG_9: tube-control (U12.3), tube-control/tube5 (R27_tube5.1 R28_tube5.1)
DIG_9: tube-control (U13.5), tube-control/tube6 (R27_tube6.1 R28_tube6.1)
DISPLAY_SPI_A0: chronos-core (U14.45), config-interface (DS1.38)
DISPLAY_SPI_CLK: chronos-core (U14.44), config-interface (DS1.37)
DISPLAY_SPI_MOSI: chronos-core (U14.46), config-interface (DS1.36)
ENA_1_5V: tube-control (U5.21), tube-control/tube1 (R30_tube1.2 R32_tube1.2)
ENA_2_5V: tube-control (U5.20), tube-control/tube2 (R30_tube2.2 R32_tube2.2)
ENA_3_5V: tube-control (U5.19), tube-control/tube3 (R30_tube3.2 R32_tube3.2)
ENA_4_5V: tube-control (U5.18), tube-control/tube4 (R30_tube4.2 R32_tube4.2)
ENA_5_5V: tube-control (U5.17), tube-control/tube5 (R30_tube5.2 R32_tube5.2)
ENA_6_5V: tube-control (U5.16), tube-control/tube6 (R30_tube6.2 R32_tube6.2)
GPIO_C6: chronos-core (U14.63), tube-control (U5.6)
GPIO_C7: chronos-core (U14.64), tube-control (U5.7)
GPIO_C8: chronos-core (U14.65), tube-control (U5.8)
GPIO_D10: chronos-core (U14.57), tube-control (U4.3)
GPIO_D11: chronos-core (U14.58), tube-control (U4.4)
GPIO_D12: chronos-core (U14.59), tube-control (U4.5)
GPIO_D13: chronos-core (U14.60), tube-control (U5.3)
GPIO_D14: chronos-core (U14.61), tube-control (U5.4)
GPIO_D15: chronos-core (U14.62), tube-control (U5.5)
GPS_EXTINT: chronos-core (U14.17), gps (MD1.5)
GPS_I2C_SCL: chronos-core (U14.15), gps (MD1.17 R40.2)
GPS_I2C_SDA: chronos-core (U14.16), gps (MD1.16 R39.2)
GPS_TIMEPULSE: chronos-core (U14.18), gps (MD1.4)
WIFI_BUCK_EN: chronos-core (U14.38), wifi (R37.1 U15.30)
WIFI_HOST_IRQ: chronos-core (U14.39), wifi (U15.46)
WIFI_IOVDD_EN: chronos-core (U14.37), wifi (U16.B2)
WIFI_QSPI_CLK: chronos-core (U14.41), wifi (U15.35)
WIFI_QSPI_DATA0: chronos-core (U14.36), wifi (U15.37)
WIFI_QSPI_DATA1: chronos-core (U14.35), wifi (U15.38)
WIFI_QSPI_DATA2: chronos-core (U14.32), wifi (U15.39)
WIFI_QSPI_DATA3: chronos-core (U14.31), wifi (U15.40)